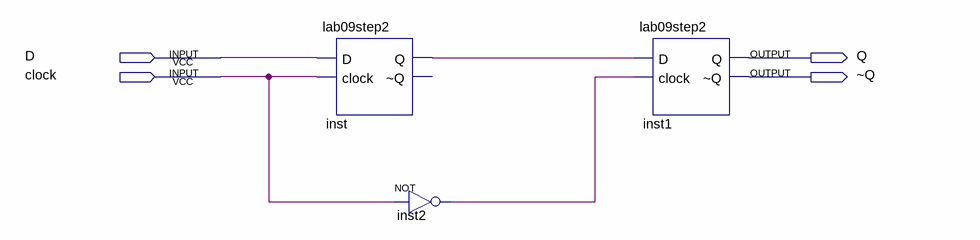
[diagram p0: schematic sheet]
// Quartus schematic lab09step3a.bdf as structural Verilog: 3 symbols, 4 pins
module lab09step3a (
  input  D,
  input  clock,
  output Q,
  output \~Q 
);

  wire inst2_out, inst_q;

  lab09step2 inst (.D(D), .clock(clock), .Q(inst_q));  // open: ~Q
  not inst2 (inst2_out, clock);
  lab09step2 inst1 (.D(inst_q), .clock(inst2_out), .Q(Q), .\~Q (\~Q ));
endmodule
